# Altium schematic sheet LowPassFilter.SchDoc
size A; SheetNumber: 4; SheetTotal: 6
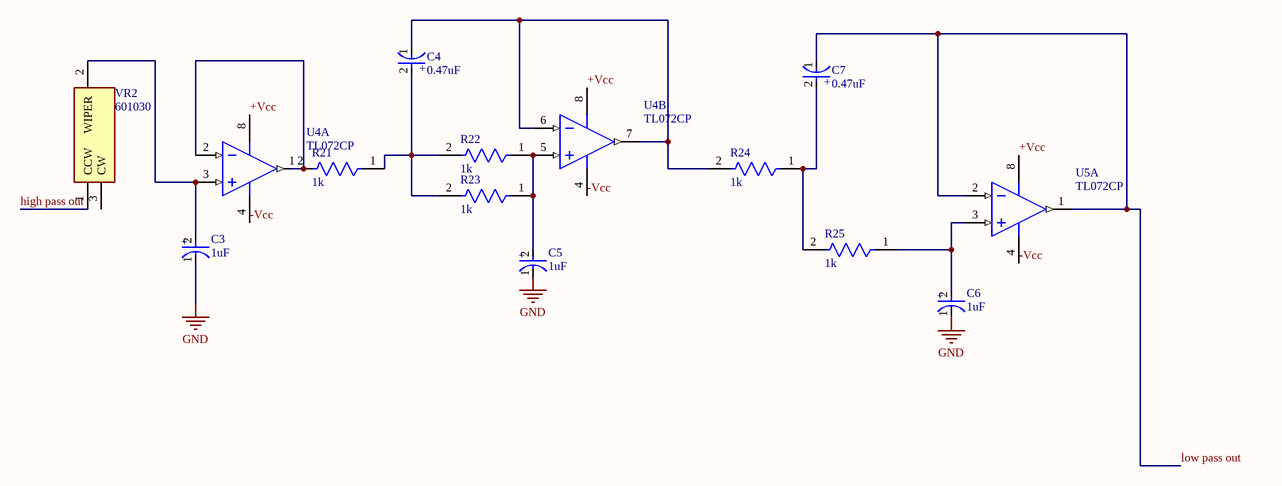
[diagram p0: LowPassFilter.SchDoc]

## Parts
C3  1uF  [FP-TAP105K035SCS-MFG]
C4  0.47uF  [FP-RAD-TH-D_5_0_5-L_11_1-MFG]
C5  1uF  [FP-TAP105K035SCS-MFG]
C6  1uF  [FP-TAP105K035SCS-MFG]
C7  0.47uF  [FP-RAD-TH-D_5_0_5-L_11_1-MFG]
R21  1k  [FP-CFR-25-MFG]
R22  1k  [FP-CFR-25-MFG]
R23  1k  [FP-CFR-25-MFG]
R24  1k  [FP-CFR-25-MFG]
R25  1k  [FP-CFR-25-MFG]
U4  TL072CP  [P0008A]  (parts A,B of 2)
U5  TL072CP  [P0008A]  (part A of 2)
VR2  601030  [601030]

## Nets
GND: C3.1(C) C5.1(C) C6.1(C)
+Vcc: U4.8(VCC+) U5.8(VCC+)
-Vcc: U4.4(VCC-) U5.4(VCC-)
high pass out: VR2.1(CCW)
low pass out: C7.1(C) U5.1(OUT1) U5.2(IN1-)
NetC3_2: C3.2(A) U4.3(IN1+) VR2.2(WIPER)
NetC4_1: C4.1(C) R24.2 U4.6(IN2-) U4.7(OUT2)
NetC4_2: C4.2(A) R21.1 R22.2 R23.2
NetC5_2: C5.2(A) R22.1 R23.1 U4.5(IN2+)
NetC6_2: C6.2(A) R25.1 U5.3(IN1+)
NetC7_2: C7.2(A) R24.1 R25.2
NetR21_2: R21.2 U4.1(OUT1) U4.2(IN1-)

Not connected (* = marked no-connect by the designer): VR2 3(CW)

## Notes on the sheet
- (in symbol CMP-04424-000622-1) +
- (in symbol CMP-05427-001047-1) +

## Library data of the parts
C3 C5 C6 = CMP-04424-000622-1: CAP TANT 1UF 10% 35V RADIAL; Lead Diameter: 0.5mm; Voltage: 20V; Leakage Current: 500nA; Dissipation Factor: 4%; Life (Hours): 1000Hour; ESR (Equivalent Series Resistance): 8R; Polarity: Polar; Dielectric Material: Tantalum; Termination: Radial; Packaging: Bulk; Construction: RADIAL; Lead Free: Lead Free; Capacitance: 1uF; Package Quantity: 1000; REACH SVHC: No SVHC; Radiation Hardening: No; Number of Pins: 2; Case/Package: Dipped; Voltage Rating: 35V; Lead Pitch: 2.5mm; Min Operating Temperature: -55°C; Voltage Rating (DC): 35V; Features: General Purpose; Mount: Through Hole; Tolerance: 10%; Height - Seated (Max): 0.276inch; Max Operating Temperature: 125°C; Series: TAP; Height: 7mm; Length: 7mm; Diameter: 4.5mm; RoHS Compliant: Yes
C4 C7 = CMP-05427-001047-1: Aluminum Electrolytic Capacitors (Radial Lead Type) 0.47uF ±20% 63V; Life (Hours): 5000Hour; Ripple Current: 4.5mA; Lead Diameter: 0.5mm; Leakage Current: 3uA; Capacitance: 470nF; Polarity: Polar; Construction: RADIAL; Number of Pins: 2; Tolerance: 20%; Series: EB; Voltage Rating: 63V; Min Operating Temperature: -40°C; Lead Pitch: 2mm; Termination: Radial; Voltage Rating (DC): 63V; Package Quantity: 200; REACH SVHC: No SVHC; Length: 11mm; Ripple Current (AC): 4.5mA; Height - Seated (Max): 0.433inch; Diameter: 5mm; Height: 11mm; Lead Free: Lead Free; RoHS Compliant: Yes; Mount: Through Hole; Voltage: 63V; Radiation Hardening: No; Packaging: Bulk; Max Operating Temperature: 105°C; Case/Package: Radial
R21-R25 = CMP-03413-000009-1: RES 10 OHM 1/4W 5% AXIAL; Resistance: 10R; Temperature Coefficient: 500ppm/°C; Max Power Dissipation: 250mW; RoHS Compliant: Yes; Packaging: Bulk; Series: Carbon Film; Case/Package: Axial; Max Operating Temperature: 155°C; Min Operating Temperature: -55°C; Number of Terminations: 2; Length: 0.248inch; Resistor Type: Carbon Film; Tolerance: 5%; Package Quantity: 200
U4 U5 = CMP-0017-00950-2: Dual Low-Noise JFET-Input General-Purpose Operational Amplifier, 7 to 36 V, 0 to 70 degC, 8-pin DIP (P8), Pb-Free (RoHS); Manufacturer: Texas Instruments; Sub Family: General Purpose Amplifier, High Supply Voltage Amplifier (>=30V); Total Supply Voltage(Max)(+5V is 5, +/-5V is 10): 36; Slew Rate(Typ)(V/us): 13; Vn at 1kHz(Typ)(nV/rtHz): 18; GBW(Typ)(MHz): 3; CMRR(Min)(dB): 70; Total Supply Voltage(Min)(+5V is 5, +/-5V is 10): 7; Vio (25C)(Max)(mV): 10; Rating: Catalog; IIB(Max)(pA): 200; Iq per channel(Max)(mA): 2.5; Number of Channels: 2; Mounting Technology: Through Hole; ComponentLink3Description: Package Specification; PartNumber: TL072CP; PackageVersion: 4040082/E, 04/2010; Eco-Plan: Pb-Free (RoHS); DatasheetVersion: SLOS080J; Offset Drift(Typ)(uV/C): 18; ComponentLink3URL: http://www.ti.com/litv/pdf/mpdi001b; PackageDescription: 8-Pin Plastic In-Line, Body 9.59 x 6.35 mm, Pitch 2.54 mm; Code_JEDEC: MS-001; ComponentLink2URL: http://www.ti.com/lit/ds/symlink/tl072.pdf; ComponentLink1Description: Manufacturer URL; ComponentLink2Description: Datasheet; ComponentLink1URL: http://www.ti.com/; PackageReference: P0008A
VR2 = 601030: Variable Resistor; Manufacturer_Name: AVX; Datasheet Link: https://www.abelektronik.de/fileadmin/images/Produkte_und_Datenblaetter/Datenblaetter/Bauelemente/E_HA06.pdf; Height: 7.8mm; Manufacturer_Part_Number: 601030; Mouser Part Number: 581-601030; Mouser Price/Stock: https://www.mouser.co.uk/ProductDetail/AVX/601030?qs=B6kkDfuK7%2FDwxok08zuurA%3D%3D